# Altium schematic sheet mcu.SchDoc
size A
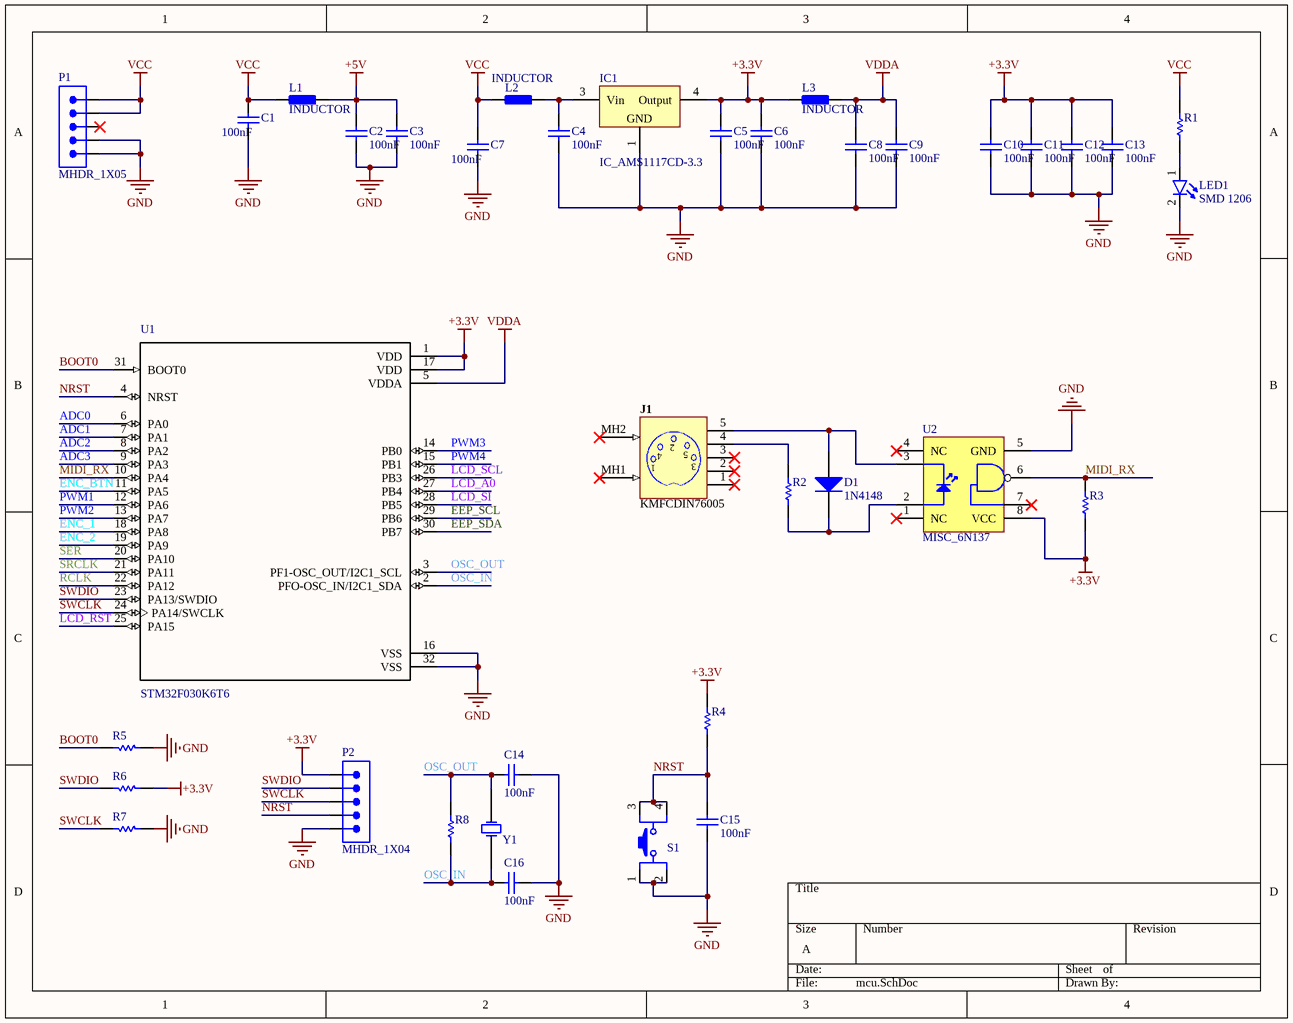
[diagram p0: mcu.SchDoc]

## Parts
C1  100nF  [CAPC3216M (1206)]
C2  100nF  [CAPC3216M (1206)]
C3  value 100nF  [CAPC3216M (1206)]  (hidden comment: 1uF)
C4  100nF  [CAPC3216M (1206)]
C5  100nF  [CAPC3216M (1206)]
C6  100nF  [CAPC3216M (1206)]
C7  100nF  [CAPC3216M (1206)]
C8  100nF  [CAPC3216M (1206)]
C9  value 100nF  [CAPC3216M (1206)]  (hidden comment: 1uF)
C10  100nF  [CAPC3216M (1206)]
C11  100nF  [CAPC3216M (1206)]
C12  100nF  [CAPC3216M (1206)]
C13  100nF  [CAPC3216M (1206)]
C14  100nF  [CAPC3216M (1206)]
C15  100nF  [CAPC3216M (1206)]
C16  100nF  [CAPC3216M (1206)]
D1  1N4148  [LL4148]
IC1  IC_AMS1117CD-3.3  [TO252-3M]
J1  KMFCDIN76005  [DIP_CON_DIN5]
L1  INDUCTOR  [INDC4532]
L2  INDUCTOR  [INDC4532]
L3  INDUCTOR  [INDC4532]
LED1  Size: SMD 1206  [LED SMD 1206]  (hidden comment: Red)
P1  MHDR_1X05  [MHDR1X05-254P]
P2  MHDR_1X04  [MHDR1X04-254P]
R1  1K  [RESC3216X60M (1206)]  (value not drawn)
R2  1K  [RESC3216X60M (1206)]  (value not drawn)
R3  1K  [RESC3216X60M (1206)]  (value not drawn)
R4  1K  [RESC3216X60M (1206)]  (value not drawn)
R5  1K  [RESC2012M (0805)]  (value not drawn)
R6  1K  [RESC3216X60M (1206)]  (value not drawn)
R7  1K  [RESC3216X60M (1206)]  (value not drawn)
R8  1K  [RESC3216X60M (1206)]  (value not drawn)
S1  SW_PB4A  [THT_ALPS_SKHHBVA010]  (value not drawn)
U1  STM32F030K6T6  [*QFP80P900X900X160-32N]
U2  MISC_6N137  [CDIP8]
Y1  11.0592 MHz  [XTAL]  (value not drawn)

## Nets
+3.3V: C5.1(+) C6.1(+) C10.1(+) C11.1(+) C12.1(+) C13.1(+) IC1.4(Output) L3.1 P2.1 R3.1 R4.2 R6.2 U1.1(VDD) U1.17(VDD) U2.8(VCC)
+5V: C2.1(+) C3.1(+) L1.2
GND: C1.2(-) C2.2(-) C3.2(-) C4.2(-) C5.2(-) C6.2(-) C7.2(-) C8.2(-) C9.2(-) C10.2(-) C11.2(-) C12.2(-) C13.2(-) C14.1(+) C15.2(-) C16.2(-) IC1.1(GND) LED1.2(K) P1.4 P1.5 P2.4 R5.2 R7.2 S1.1 S1.2 U1.16(VSS) U1.32(VSS) U2.5(GND)
VCC: C1.1(+) C7.1(+) L1.1 L2.1 P1.1 P1.2 R1.2
VDDA: C8.1(+) C9.1(+) L3.2 U1.5(VDDA)
ADC0: U1.6(PA0)
ADC1: U1.7(PA1)
ADC2: U1.8(PA2)
ADC3: U1.9(PA3)
BOOT0: R5.1 U1.31(BOOT0)
EEP_SCL: U1.29(PB6)
EEP_SDA: U1.30(PB7)
ENC_1: U1.18(PA8)
ENC_2: U1.19(PA9)
ENC_BTN: U1.11(PA5)
LCD_A0: U1.27(PB4)
LCD_RST: U1.25(PA15)
LCD_SCL: U1.26(PB3)
LCD_SI: U1.28(PB5)
MIDI_RX: R3.2 U1.10(PA4) U2.6(Vo)
NRST: C15.1(+) P2.4 R4.1 S1.3 S1.4 U1.4(NRST)
OSC_IN: C16.1(+) R8.1 U1.2(PFO-OSC_IN/I2C1_SDA) Y1.2(OSC2)
OSC_OUT: C14.2(-) R8.2 U1.3(PF1-OSC_OUT/I2C1_SCL) Y1.1(OSC1)
PWM1: U1.12(PA6)
PWM2: U1.13(PA7)
PWM3: U1.14(PB0)
PWM4: U1.15(PB1)
RCLK: U1.22(PA12)
SER: U1.20(PA10)
SRCLK: U1.21(PA11)
SWCLK: P2.3 R7.1 U1.24(PA14/SWCLK)
SWDIO: P2.2 R6.1 U1.23(PA13/SWDIO)
NetC4_1: C4.1(+) IC1.3(Vin) L2.2
NetD1_1: D1.1(A) J1.5 U2.3(K)
NetD1_2: D1.2(K) R2.2 U2.2(A)
NetJ1_4: J1.4 R2.1
NetLED1_1: LED1.1(A) R1.1

Not connected (* = marked no-connect by the designer): J1 1* 2* 3* MH1* MH2*; P1 3*; U2 1(NC)* 4(NC)* 7(Ve)*

## Library data of the parts
C1-C16 = CAP_Bipolar: Bipolar Capacitor; Voltage: 100V; Designer: Eng. Saeid Jorablo; Company: SJ Libraries; ComponentLink1Description: Datasheet; ComponentLink2Description: Reference; Publisher: SJ Unlimited; Mounting Technology: *; Mounting Technology: Surface Mount\Through-Hole; HelpURL: http://s3.picofile.com/file/7443264187/Coming_Soon_logo.gif; Status: Unreleased
  C1 C2 C4-C8 C10-C16: Value: 100nF
D1 = DIODE_1N4148: High Conductance Fast Diode; Designer: Eng. Saeid Jorablo; Company: SJ Libraries; Published: 8-Jun-2000; LatestRevisionDate: 17-Jul-2002; LatestRevisionNote: Re-released for DXP Platform.; PackageReference: DO-35; Publisher: SJ Unlimited; PackageDescription: Diode, Axial; Body 3.8 x 1.9 mm (LxDia. max), Lead Dia. 0.53 mm (max); Code_JEDEC: DO-204-AH; ComponentLink1Description: Datasheet; ComponentLink1URL: http://www.fairchildsemi.com/; ComponentLink2Description: Reference; ComponentLink2URL: http://www.fairchildsemi.com/ds/1N%2F1N4148.pdf; Mounting Technology: Surface Mount\Through-Hole; HelpURL: http://s3.picofile.com/file/7443264187/Coming_Soon_logo.gif; Status: Unreleased
IC1 = IC_AMS1117CD-3.3: 800mA LOW DROPOUT VOLTAGE REGULATOR; Manufacturer: Advanced Monolithic Systems, Inc.; Company: SJ Libraries; Designer: Eng. Saeid Jorablo; ESD Sensetive: True/False; Code_IPC: TO-252; ComponentLink1Description: Datasheet; ComponentLink1URL: http://www.advanced-monolithic.com/pdf/ds1117.pdf; ComponentLink2Description: Reference; ComponentLink2URL: http://www.advanced-monolithic.com/index.html; PackageDescription: D-PAK, 3-Pads, Body 6.2x6.7mm (max); PinCount: 3; Update: 6/5/2012; Category: Integrated Circuit; Status: Unrelease; HelpURL: http://s3.picofile.com/file/7443264187/Coming_Soon_logo.gif; Operating Temperature: -55 ~ +125 (C); Mounting Technology: Surface Mount; RoHS compliant: True/False
J1 = CON_DIN5: Socket, 5-way R/A DIN; Connector type: Right Angle; Max Current: mA; designer: Eng. Saeid Jorablo; Company: SJ Libraries; Mounting Technology: Through-Hole; Pin Count: 5; Status: Unreleased; Category: Connector; Publisher: SJ UnLimited; ComponentLink1Description: Datasheet; ComponentLink2Description: Reference; Update: 7/8/2012; HelpURL: http://s3.picofile.com/file/7443264187/Coming_Soon_logo.gif
L1-L3 = INDUCTOR: Code_IEC: 1005; Designer: Eng. Saeid Jorablo; Company: SJ Libraries; Value: 10mH; Published: 8-Jun-2000; LatestRevisionDate: 29-May-2009; LatestRevisionNote: IPC-7351 Footprint Added.; PackageReference: 0402-A; Publisher: SJ Unlimited; PackageDescription: Chip Inductor; Code_JEITA: 0402; ComponentLink1Description: Datasheet; ComponentLink2Description: Reference; Mounting Technology: Surface Mount\Through-Hole; HelpURL: http://s3.picofile.com/file/7443264187/Coming_Soon_logo.gif; Status: Unreleased
LED1 = LED: Designer: Eng. Saeid Jorablo; Company: SJ Libraries; ComponentLink1Description: Datasheet; ComponentLink2Description: Reference; Publisher: SJ Unlimited; Mounting Technology: Surface Mount\Through-Hole; Color: Red; HelpURL: http://s3.picofile.com/file/7443264187/Coming_Soon_logo.gif; Status: Unreleased
P1 P2 = MHDR_1X05: Male Header 1X05
R1-R8 = RES: Resistor; Designer: Eng. Saeid Jorablo; Company: SJ Libraries; Tolerance: 5%; Power: 1/8 W; Category: Resistors; ComponentLink1Description: Datasheet; ComponentLink2Description: Reference; PackageDescription: SMD & TH Resistors; Publisher: SJ Unlimited; Mounting Technology: Surface Mount\Through-Hole; HelpURL: http://s3.picofile.com/file/7443264187/Coming_Soon_logo.gif; Status: Unreleased; Value: 1K
S1 = SW_PB4A: 4 Pin Push Button Switch; Company: SJ Libraries; Designer: Eng. Saeid Jorablo; Mounting Technology: Surface Mount\Through-Hole; ComponentLink1Description: Datasheet; Pin Count: 0; Update Date: 6/3/2012; Category: MISC; HelpURL: http://s3.picofile.com/file/7443264187/Coming_Soon_logo.gif
U1 = STM32F030K6T6: MCU 32-Bit STM32F ARM Cortex M0 RISC 32KB Flash 2.5V/3.3V 32-Pin LQFP Tray; MF: STMicroelectronics; MP: STM32F030K6T6; Price: None; SnapEDA_Link: https://www.snapeda.com/parts/STM32F030K6T6/STMicroelectronics/view-part/?ref=snap; Availability: Unavailable; Package: LQFP-32 STMicroelectronics; Value: *
U2 = MISC_6N137: HIGH SPEED-10 MBit/s  LOGIC GATE OPTOCOUPLERS; Designer: Eng. Saeid Jorablo; Company: SJ Libraries; Mounting Technology: Surface Mount\Through-Hole; ComponentLink1Description: Datasheet; Pin Count: 0; Update Date: 6/3/2012; Category: MISC; HelpURL: http://s3.picofile.com/file/7443264187/Coming_Soon_logo.gif
Y1 = XTAL_Crystal: XTAL Crystal; Company: SJ Libraries; Designer: Eng. Saeid Jorablo; Design Date: 11/04/2011; ComponentLink1Description: Datasheet; ComponentLink2Description: Reference; Publisher: SJ Unlimited; Mounting Technology: Surface Mount\Through-Hole; Value: 11.0592 MHz; HelpURL: http://s3.picofile.com/file/7443264187/Coming_Soon_logo.gif; Status: Unreleased